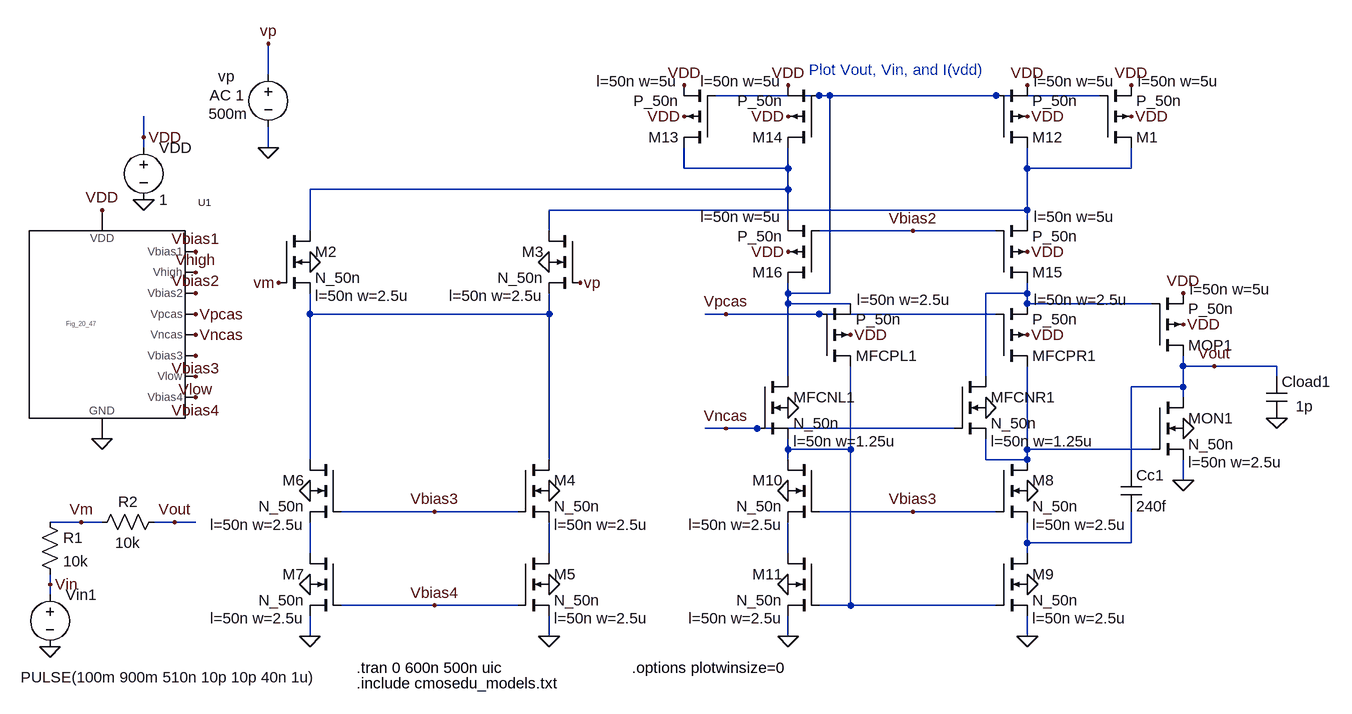
[diagram p0: schematic Fig24_47_tran.asc]
Fig24_47_tran.asc, the LTspice schematic file:
Version 4
SHEET 1 3376 680
WIRE 1552 -1072 1552 -1120
WIRE 2400 -1040 2240 -1040
WIRE 2416 -1040 2400 -1040
WIRE 2672 -1040 2416 -1040
WIRE 2832 -1040 2672 -1040
WIRE 1360 -976 1360 -1008
WIRE 1360 -960 1360 -976
WIRE 1552 -960 1552 -992
WIRE 2192 -928 2192 -960
WIRE 2352 -928 2352 -960
WIRE 2352 -928 2192 -928
WIRE 2720 -928 2720 -960
WIRE 2880 -928 2880 -960
WIRE 2880 -928 2720 -928
WIRE 2352 -896 2352 -928
WIRE 2352 -896 1616 -896
WIRE 2720 -864 2720 -928
WIRE 2720 -864 1984 -864
WIRE 2352 -848 2352 -896
WIRE 2720 -848 2720 -864
WIRE 1616 -832 1616 -896
WIRE 1984 -832 1984 -864
WIRE 2544 -832 2400 -832
WIRE 2672 -832 2544 -832
WIRE 2352 -736 2352 -752
WIRE 2416 -736 2416 -1040
WIRE 2416 -736 2352 -736
WIRE 2720 -736 2720 -752
WIRE 2720 -736 2656 -736
WIRE 2352 -720 2352 -736
WIRE 2448 -720 2352 -720
WIRE 2720 -720 2720 -736
WIRE 2912 -720 2720 -720
WIRE 1616 -704 1616 -736
WIRE 1984 -704 1984 -736
WIRE 1984 -704 1616 -704
WIRE 2256 -704 2224 -704
WIRE 2400 -704 2256 -704
WIRE 2672 -704 2400 -704
WIRE 2960 -624 2960 -640
WIRE 3008 -624 2960 -624
WIRE 3104 -624 3008 -624
WIRE 2352 -608 2352 -720
WIRE 2656 -608 2656 -736
WIRE 3104 -608 3104 -624
WIRE 2960 -592 2960 -624
WIRE 2960 -592 2880 -592
WIRE 2960 -576 2960 -592
WIRE 2256 -528 2224 -528
WIRE 2304 -528 2256 -528
WIRE 2608 -528 2304 -528
WIRE 2352 -496 2352 -512
WIRE 2448 -496 2448 -624
WIRE 2448 -496 2352 -496
WIRE 2720 -496 2720 -624
WIRE 2912 -496 2720 -496
WIRE 1616 -480 1616 -704
WIRE 1984 -480 1984 -704
WIRE 2352 -480 2352 -496
WIRE 2656 -480 2656 -512
WIRE 2720 -480 2720 -496
WIRE 2720 -480 2656 -480
WIRE 2880 -464 2880 -592
WIRE 2960 -448 2960 -480
WIRE 1808 -400 1664 -400
WIRE 1936 -400 1808 -400
WIRE 2544 -400 2400 -400
WIRE 2672 -400 2544 -400
WIRE 1264 -384 1216 -384
WIRE 1296 -384 1264 -384
WIRE 1408 -384 1376 -384
WIRE 1440 -384 1408 -384
WIRE 2720 -352 2720 -384
WIRE 2880 -352 2880 -400
WIRE 2880 -352 2720 -352
WIRE 1616 -336 1616 -384
WIRE 1984 -336 1984 -384
WIRE 2352 -336 2352 -384
WIRE 2720 -336 2720 -352
WIRE 1216 -288 1216 -304
WIRE 1216 -272 1216 -288
WIRE 1808 -256 1664 -256
WIRE 1936 -256 1808 -256
WIRE 2448 -256 2448 -496
WIRE 2448 -256 2400 -256
WIRE 2672 -256 2448 -256
WIRE 1616 -208 1616 -240
WIRE 1984 -208 1984 -240
WIRE 2352 -208 2352 -240
WIRE 2720 -208 2720 -240
FLAG 1360 -880 0
FLAG 1360 -976 VDD
FLAG 1296 -864 VDD
FLAG 1296 -512 0
FLAG 1440 -800 Vbias1
FLAG 1440 -768 Vhigh
FLAG 1440 -736 Vbias2
FLAG 1440 -640 Vbias3
FLAG 1440 -704 Vpcas
FLAG 1440 -672 Vncas
FLAG 1440 -576 Vbias4
FLAG 1440 -608 Vlow
FLAG 1552 -960 0
FLAG 1552 -1120 vp
FLAG 1216 -192 0
FLAG 1408 -384 Vout
FLAG 1264 -384 Vm
FLAG 1216 -288 Vin
FLAG 2880 -1008 VDD
FLAG 1616 -784 0
FLAG 1984 -784 0
FLAG 1568 -752 vm
FLAG 2032 -752 vp
FLAG 1984 -432 0
FLAG 1984 -288 0
FLAG 1984 -208 0
FLAG 1616 -432 0
FLAG 1616 -288 0
FLAG 1616 -208 0
FLAG 1808 -400 Vbias3
FLAG 1808 -256 Vbias4
FLAG 2720 -432 0
FLAG 2720 -288 0
FLAG 2720 -208 0
FLAG 2352 -432 0
FLAG 2352 -288 0
FLAG 2352 -208 0
FLAG 2544 -400 Vbias3
FLAG 2720 -1008 VDD
FLAG 2720 -1056 VDD
FLAG 2880 -1056 VDD
FLAG 2192 -1008 VDD
FLAG 2352 -1008 VDD
FLAG 2352 -1056 VDD
FLAG 2192 -1056 VDD
FLAG 2720 -800 VDD
FLAG 2352 -800 VDD
FLAG 2544 -832 Vbias2
FLAG 3104 -544 0
FLAG 3008 -624 Vout
FLAG 2448 -672 VDD
FLAG 2720 -672 VDD
FLAG 2656 -560 0
FLAG 2352 -560 0
FLAG 2256 -704 Vpcas
FLAG 2256 -528 Vncas
FLAG 2960 -688 VDD
FLAG 2960 -736 VDD
FLAG 2960 -528 0
FLAG 2960 -448 0
SYMBOL voltage 1360 -976 R0
WINDOW 123 0 0 Left 2
WINDOW 39 0 0 Left 2
SYMATTR InstName VDD
SYMATTR Value 1
SYMBOL Fig_20_47 1296 -688 R0
SYMATTR InstName U1
SYMBOL voltage 1552 -1088 R0
WINDOW 0 -77 18 Left 2
WINDOW 3 -92 76 Left 2
WINDOW 123 -90 47 Left 2
WINDOW 39 0 0 Left 2
SYMATTR InstName vp
SYMATTR Value 500m
SYMATTR Value2 AC 1
SYMBOL voltage 1216 -288 R0
WINDOW 3 -45 143 Left 2
WINDOW 123 0 0 Left 2
WINDOW 39 0 0 Left 2
SYMATTR Value PULSE(100m 900m 510n 10p 10p 40n 1u)
SYMATTR InstName Vin1
SYMBOL res 1200 -400 R0
SYMATTR InstName R1
SYMATTR Value 10k
SYMBOL res 1280 -368 R270
WINDOW 0 32 56 VTop 2
WINDOW 3 0 56 VBottom 2
SYMATTR InstName R2
SYMATTR Value 10k
SYMBOL pmos4 2832 -960 M180
WINDOW 123 58 102 Left 2
WINDOW 0 56 16 Left 2
SYMATTR Value2 l=50n w=5u
SYMATTR InstName M1
SYMATTR Value P_50n
SYMBOL nmos4 1568 -832 R0
WINDOW 123 56 100 Left 2
SYMATTR Value2 l=50n w=2.5u
SYMATTR InstName M2
SYMATTR Value N_50n
SYMBOL nmos4 2032 -832 M0
WINDOW 123 56 100 Left 2
SYMATTR Value2 l=50n w=2.5u
SYMATTR InstName M3
SYMATTR Value N_50n
SYMBOL nmos4 1936 -480 R0
WINDOW 123 56 100 Left 2
SYMATTR Value2 l=50n w=2.5u
SYMATTR InstName M4
SYMATTR Value N_50n
SYMBOL nmos4 1936 -336 R0
WINDOW 123 56 100 Left 2
SYMATTR Value2 l=50n w=2.5u
SYMATTR InstName M5
SYMATTR Value N_50n
SYMBOL nmos4 1664 -480 M0
WINDOW 123 56 100 Left 2
SYMATTR Value2 l=50n w=2.5u
SYMATTR InstName M6
SYMATTR Value N_50n
SYMBOL nmos4 1664 -336 M0
WINDOW 123 56 100 Left 2
SYMATTR Value2 l=50n w=2.5u
SYMATTR InstName M7
SYMATTR Value N_50n
SYMBOL nmos4 2672 -480 R0
WINDOW 123 56 100 Left 2
SYMATTR Value2 l=50n w=2.5u
SYMATTR InstName M8
SYMATTR Value N_50n
SYMBOL nmos4 2672 -336 R0
WINDOW 123 56 100 Left 2
SYMATTR Value2 l=50n w=2.5u
SYMATTR InstName M9
SYMATTR Value N_50n
SYMBOL nmos4 2400 -480 M0
WINDOW 123 56 100 Left 2
SYMATTR Value2 l=50n w=2.5u
SYMATTR InstName M10
SYMATTR Value N_50n
SYMBOL nmos4 2400 -336 M0
WINDOW 123 56 100 Left 2
SYMATTR Value2 l=50n w=2.5u
SYMATTR InstName M11
SYMATTR Value N_50n
SYMBOL pmos4 2672 -960 M180
WINDOW 123 58 102 Left 2
WINDOW 0 56 16 Left 2
SYMATTR Value2 l=50n w=5u
SYMATTR InstName M12
SYMATTR Value P_50n
SYMBOL pmos4 2240 -960 R180
WINDOW 123 58 102 Left 2
WINDOW 0 56 16 Left 2
SYMATTR Value2 l=50n w=5u
SYMATTR InstName M13
SYMATTR Value P_50n
SYMBOL pmos4 2400 -960 R180
WINDOW 123 58 102 Left 2
WINDOW 0 56 16 Left 2
SYMATTR Value2 l=50n w=5u
SYMATTR InstName M14
SYMATTR Value P_50n
SYMBOL pmos4 2672 -752 M180
WINDOW 123 58 102 Left 2
WINDOW 0 56 16 Left 2
SYMATTR Value2 l=50n w=5u
SYMATTR InstName M15
SYMATTR Value P_50n
SYMBOL pmos4 2400 -752 R180
WINDOW 123 58 102 Left 2
WINDOW 0 56 16 Left 2
SYMATTR Value2 l=50n w=5u
SYMATTR InstName M16
SYMATTR Value P_50n
SYMBOL cap 3088 -608 R0
WINDOW 3 45 46 Left 2
SYMATTR Value 1p
SYMATTR InstName Cload1
SYMBOL pmos4 2400 -624 M180
WINDOW 123 58 102 Left 2
WINDOW 0 56 16 Left 2
SYMATTR Value2 l=50n w=2.5u
SYMATTR InstName MFCPL1
SYMATTR Value P_50n
SYMBOL pmos4 2672 -624 M180
WINDOW 123 58 102 Left 2
WINDOW 0 56 16 Left 2
SYMATTR Value2 l=50n w=2.5u
SYMATTR InstName MFCPR1
SYMATTR Value P_50n
SYMBOL nmos4 2608 -608 R0
WINDOW 123 56 100 Left 2
SYMATTR Value2 l=50n w=1.25u
SYMATTR InstName MFCNR1
SYMATTR Value N_50n
SYMBOL nmos4 2304 -608 R0
WINDOW 123 56 100 Left 2
SYMATTR Value2 l=50n w=1.25u
SYMATTR InstName MFCNL1
SYMATTR Value N_50n
SYMBOL pmos4 2912 -640 M180
WINDOW 123 58 102 Left 2
WINDOW 0 56 16 Left 2
SYMATTR Value2 l=50n w=5u
SYMATTR InstName MOP1
SYMATTR Value P_50n
SYMBOL nmos4 2912 -576 R0
WINDOW 123 56 100 Left 2
SYMATTR Value2 l=50n w=2.5u
SYMATTR InstName MON1
SYMATTR Value N_50n
SYMBOL cap 2864 -464 R0
SYMATTR InstName Cc1
SYMATTR Value 240f
TEXT 1688 -136 Left 2 !.include cmosedu_models.txt
TEXT 1688 -160 Left 2 !.tran 0 600n 500n uic
TEXT 2384 -1080 Left 2 ;Plot Vout, Vin, and I(vdd)
TEXT 2112 -160 Left 2 !.options plotwinsize=0

The netlist it stands for:
* Fig24_47_tran.asc
VDD VDD 0 1
XU1 Vbias1 Vhigh Vbias2 Vpcas Vncas Vbias3 Vlow Vbias4 VDD 0 Fig_20_47  ; pins Vbias1 Vhigh Vbias2 Vpcas Vncas Vbias3 Vlow Vbias4 VDD GND
vp vp 0 500m AC 1
Vin1 Vin 0 PULSE(100m 900m 510n 10p 10p 40n 1u)
R1 Vm Vin 10k
R2 Vm Vout 10k
M1 N003 N001 VDD VDD P_50n l=50n w=5u
M2 N002 Vm N005 0 N_50n l=50n w=2.5u
M3 N003 vp N005 0 N_50n l=50n w=2.5u
M4 N005 Vbias3 N010 0 N_50n l=50n w=2.5u
M5 N010 Vbias4 0 0 N_50n l=50n w=2.5u
M6 N005 Vbias3 N009 0 N_50n l=50n w=2.5u
M7 N009 Vbias4 0 0 N_50n l=50n w=2.5u
M8 N007 Vbias3 N008 0 N_50n l=50n w=2.5u
M9 N008 N006 0 0 N_50n l=50n w=2.5u
M10 N006 Vbias3 N011 0 N_50n l=50n w=2.5u
M11 N011 N006 0 0 N_50n l=50n w=2.5u
M12 N003 N001 VDD VDD P_50n l=50n w=5u
M13 N002 N001 VDD VDD P_50n l=50n w=5u
M14 N002 N001 VDD VDD P_50n l=50n w=5u
M15 N004 Vbias2 N003 VDD P_50n l=50n w=5u
M16 N001 Vbias2 N002 VDD P_50n l=50n w=5u
Cload1 Vout 0 1p
MFCPL1 N006 Vpcas N001 VDD P_50n l=50n w=2.5u
MFCPR1 N007 Vpcas N004 VDD P_50n l=50n w=2.5u
MFCNR1 N004 Vncas N007 0 N_50n l=50n w=1.25u
MFCNL1 N001 Vncas N006 0 N_50n l=50n w=1.25u
MOP1 Vout N004 VDD VDD P_50n l=50n w=5u
MON1 Vout N007 0 0 N_50n l=50n w=2.5u
Cc1 Vout N008 240f
.model NMOS NMOS
.model PMOS PMOS
.lib standard.mos
.include cmosedu_models.txt
.tran 0 600n 500n uic
* Plot Vout, Vin, and I(vdd)
.options plotwinsize=0
.backanno
.end